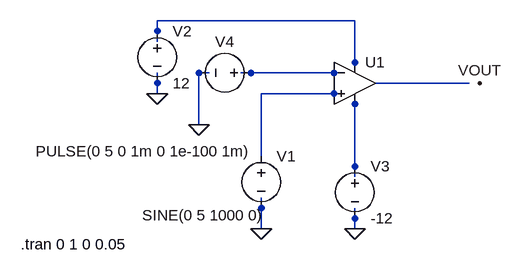
[diagram p0: schematic pwm_ver1.asc]
pwm_ver1.asc, the LTspice schematic file:
Version 4
SHEET 1 880 680
WIRE 192 16 -112 16
WIRE -112 32 -112 16
WIRE -112 48 -112 32
WIRE 192 80 192 16
WIRE -32 96 -48 96
WIRE 32 96 16 96
WIRE 160 96 32 96
WIRE 176 96 160 96
WIRE 192 96 192 80
WIRE -112 112 -112 96
WIRE 368 112 224 112
WIRE -112 128 -112 112
WIRE 160 128 48 128
WIRE 176 128 160 128
WIRE 192 144 192 128
WIRE -48 176 -48 96
WIRE 48 224 48 128
WIRE 192 240 192 144
WIRE 192 256 192 240
WIRE 48 304 48 288
WIRE 192 320 192 304
WIRE 48 336 48 304
WIRE 192 336 192 320
FLAG 192 336 0
FLAG 48 336 0
FLAG -112 128 0
FLAG -48 176 0
FLAG 384 112 VOUT
SYMBOL Opamps\\UniversalOpamp2 192 112 R0
SYMATTR InstName U1
SYMBOL voltage 48 208 R0
WINDOW 3 -183 107 Left 2
WINDOW 123 0 0 Left 2
WINDOW 39 0 0 Left 2
SYMATTR InstName V1
SYMATTR Value SINE(0 5 1000 0)
SYMBOL voltage -112 16 R0
WINDOW 123 0 0 Left 2
WINDOW 39 0 0 Left 2
SYMATTR InstName V2
SYMATTR Value 12
SYMBOL voltage 192 224 R0
WINDOW 123 0 0 Left 2
WINDOW 39 0 0 Left 2
SYMATTR InstName V3
SYMATTR Value -12
SYMBOL voltage 48 96 R90
WINDOW 0 -32 56 VBottom 2
WINDOW 3 105 181 VTop 2
WINDOW 123 0 0 Left 2
WINDOW 39 0 0 Left 2
SYMATTR InstName V4
SYMATTR Value PULSE(0 5 0 1m 0 1e-100 1m)
TEXT -322 360 Left 2 !.tran 0 1 0 0.05

The netlist it stands for:
* pwm_ver1.asc
XU1 N004 N002 N001 N005 N003 level.2 Avol=1Meg GBW=10Meg Slew=10Meg ilimit=25m rail=0 Vos=0 phimargin=45 en=0 enk=0 in=0 ink=0 Rin=500Meg  ; pins IN+ IN- V+ V- OUT
V1 N004 0 SINE(0 5 1000 0)
V2 N001 0 12
V3 N005 0 -12
V4 N002 0 PULSE(0 5 0 1m 0 1e-100 1m)
.tran 0 1 0 0.05
.lib UniversalOpamps2.sub
.backanno
.end